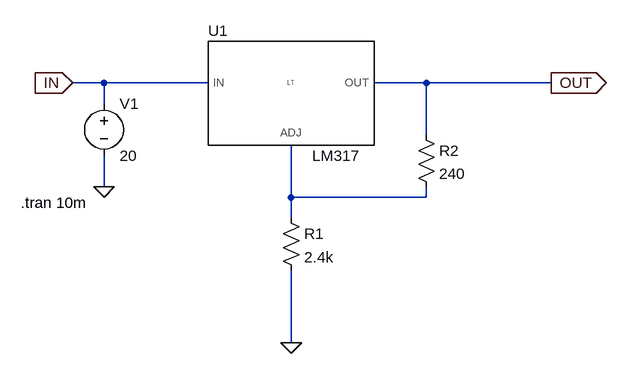
[diagram p0: schematic Regulator_LM317.asc]
Regulator_LM317.asc, the LTspice schematic file:
Version 4.1
SHEET 1 880 680
WIRE -192 128 -240 128
WIRE -32 128 -192 128
WIRE 304 128 224 128
WIRE 496 128 304 128
WIRE -192 160 -192 128
WIRE 304 208 304 128
WIRE -192 288 -192 240
WIRE 96 304 96 224
WIRE 304 304 304 288
WIRE 304 304 96 304
WIRE 96 336 96 304
WIRE 96 528 96 416
FLAG -192 288 0
FLAG 496 128 OUT
IOPIN 496 128 Out
FLAG -240 128 IN
IOPIN -240 128 In
FLAG 96 528 0
SYMBOL voltage -192 144 R0
WINDOW 123 0 0 Left 0
WINDOW 39 0 0 Left 0
SYMATTR InstName V1
SYMATTR Value 20
SYMBOL MyLib\\Regulator\\LM317 96 128 R0
SYMATTR InstName U1
SYMBOL res 80 320 R0
SYMATTR InstName R1
SYMATTR Value 2.4k
SYMBOL res 288 192 R0
SYMATTR InstName R2
SYMATTR Value 240
TEXT -320 312 Left 2 !.tran 10m

The netlist it stands for:
* Regulator_LM317.asc
V1 IN 0 20
X§U1 IN N001 OUT LM317  ; pins IN ADJ OUT
R1 N001 0 2.4k
R2 OUT N001 240
.tran 10m
.lib MyLib/Regulator/LM317.lib
.backanno
.end